# Altium schematic sheet BUCK-BOOST电路.SchDoc
size A4
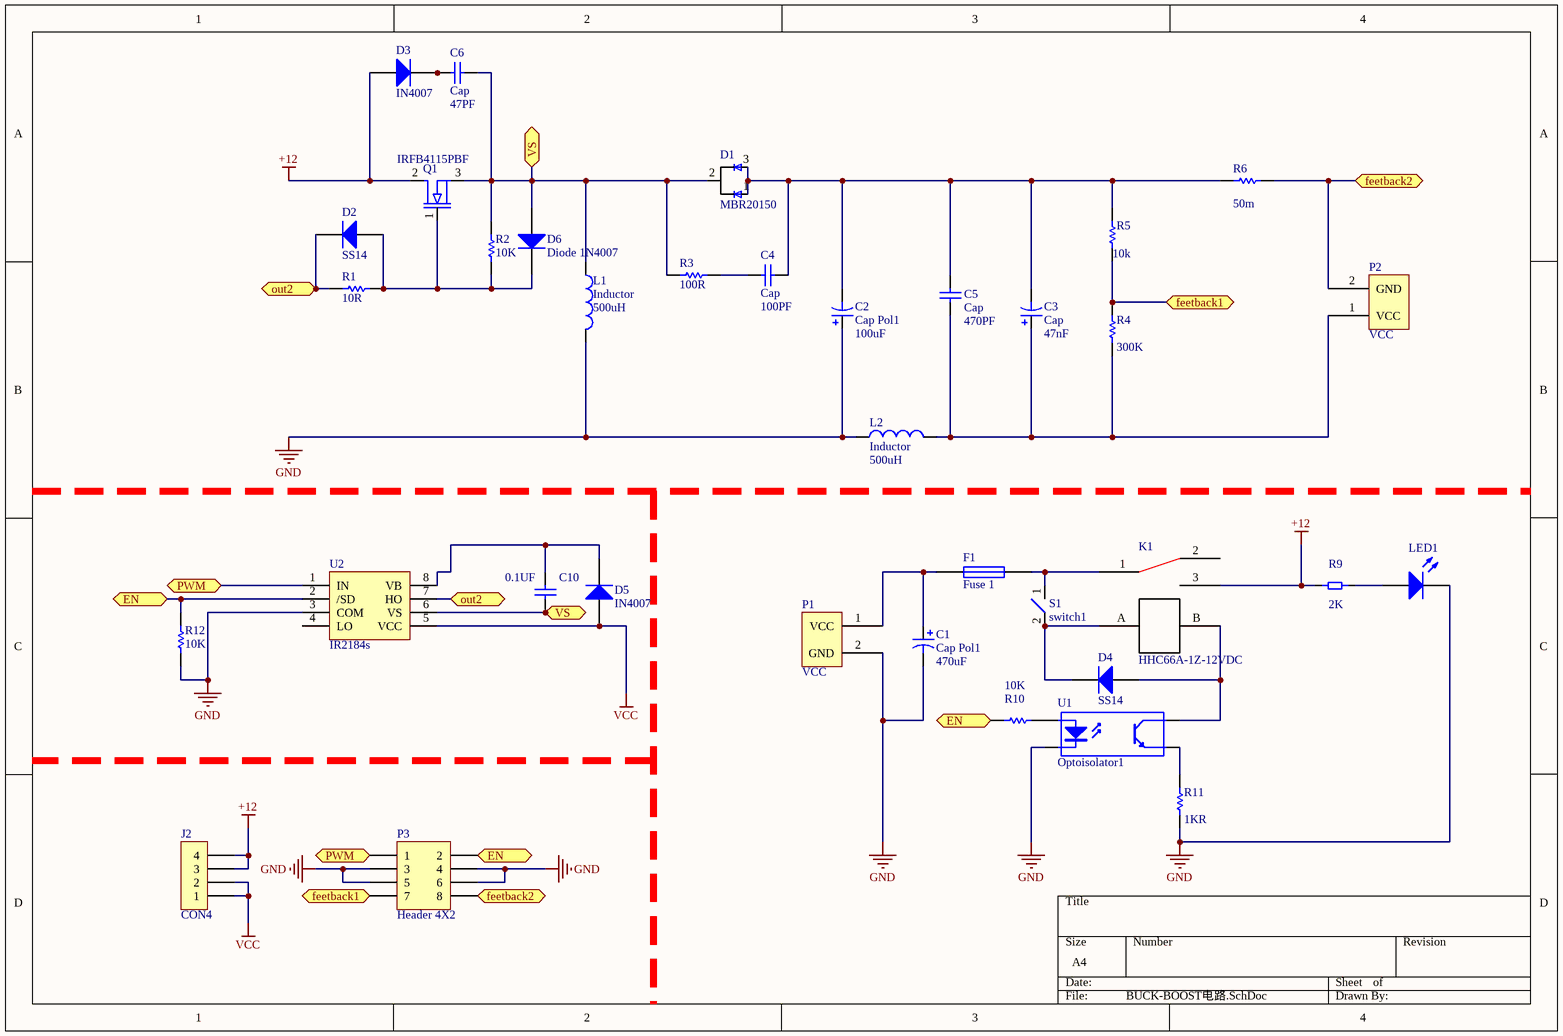
[diagram p0: BUCK-BOOST电路.SchDoc]

## Parts
C1  Cap Pol1  value 470uF  [Elector_470uf_8*9/12*3mm]
C2  Cap Pol1  value 100uF  [RB5-10.5]
C3  Cap  value 47nF  [cb2]
C4  Cap  value 100PF  [CB2]
C5  Cap  value 470PF  [cb2]
C6  Cap  value 47PF  [CB1]
C10  value 0.1UF  [1206]  (hidden comment: Cap)
D1  MBR20150  [lm317带散热片]
D2  SS14  [SK34-SMB/DO-214AA]
D3  IN4007  [AXIAL0.1Z]
D4  SS14  [SK34-SMB/DO-214AA]
D5  IN4007  [AXIAL0.1Z]
D6  Diode 1N4007  [AXIAL0.1Z]
F1  Fuse 1  [FUSE-L]
J2  CON4  [SIP4]
K1  HHC66A-1Z-12VDC  [HHC66A-1Z-12VDC电位器]
L1  Inductor  value 500uH  [BOOST升压电感2]
L2  Inductor  value 500uH  [BOOST电路滤波电感]
LED1  (no value)  [0603_LED]
P1  VCC  [050-2]
P2  VCC  [050-2]
P3  Header 4X2  [HDR2X4]
Q1  IRFB4115PBF  [lm317带散热片]
R1  value 10R  [0805r]  (hidden comment: Res1)
R2  value 10K  [AXIAL0.1Z]  (hidden comment: Res1)
R3  value 100R  [AXIAL0.1Z]  (hidden comment: Res1)
R4  value 300K  [AXIAL0.1Z]  (hidden comment: Res1)
R5  value 10k  [AXIAL0.1Z]  (hidden comment: Res1)
R6  value 50m  [AXIAL-0.7]  (hidden comment: Res1)
R9  2K  [0805R]
R10  value 10K  [0805R]  (hidden comment: Res1)
R11  value 1KR  [0805R]  (hidden comment: Res1)
R12  value 10K  [0805r]  (hidden comment: Res1)
S1  switch1  [Switch_8.2*5.2]
U1  Optoisolator1  [DIP-4]
U2  IR2184s  [SO-8NB]

## Ports
EN, feetback1, feetback2, out2, PWM, VS

## Nets
+12: D3.1(A) J2.3 J2.4 K1.3 Q1.2(D) R9.2
GND: C1.2 C2.1 L1.2 L2.1 LED1.2(K) P1.2(GND) P3.3 P3.4 P3.5 P3.6 R11.1 R12.2 U1.2(K) U2.3(COM)
VCC: D5.1(A) J2.1 J2.2 U2.5(VCC)
EN: P3.2 R10.1 R12.1 U2.2(/SD) ; port EN
feetback1: P3.7 R4.2 R5.1 ; port feetback1
feetback2: P2.2(GND) P3.8 R6.1 ; port feetback2
out2: D2.2(K) R1.1 U2.7(HO) ; port out2
PWM: P3.1 U2.1(IN) ; port PWM
VS: C6.1 C10.1 D1.2 D6.1(A) L1.1 Q1.3(S) R2.1 R3.1 U2.6(VS) ; port VS
NetC1_1: C1.1 F1.1 P1.1(VCC)
NetC2_2: C2.2 C3.2 C4.2 C5.2 D1.1 D1.3 R5.2 R6.2
NetC3_1: C3.1 C5.1 L2.2 P2.1(VCC) R4.1
NetC4_1: C4.1 R3.2
NetC6_2: C6.2 D3.2(K)
NetC10_2: C10.2 D5.2(K) U2.8(VB)
NetD2_1: D2.1(A) D6.2(K) Q1.1(G) R1.2 R2.2
NetD4_1: D4.1(A) K1.B U1.4(C)
NetD4_2: D4.2(K) K1.A S1.2
NetF1_2: F1.2 K1.1 S1.1
NetLED1_1: LED1.1(A) R9.1
NetR10_2: R10.2 U1.1(A)
NetR11_2: R11.2 U1.3(E)

Not connected (* = marked no-connect by the designer): K1 2; U2 4(LO)

## Library data of the parts
C1-C3 = Cap Pol1: Polarized Capacitor (Radial); Published: 8-Jun-2000; LatestRevisionDate: 17-Jul-2002; LatestRevisionNote: Re-released for DXP Platform.; PackageReference: RB7.6-15; Publisher: Altium Limited; PackageDescription: Polarized Capacitor (Radial); 2 Leads
C4-C6 C10 = Cap: Capacitor; Published: 8-Jun-2000; LatestRevisionDate: 17-Jul-2002; LatestRevisionNote: Re-released for DXP Platform.; PackageReference: RAD-0.3; Publisher: Altium Limited; PackageDescription: Radial Cap, Thru-Hole; 2 Leads; 0.3 in Pin Spacing
D2-D5 = Diode: Default Diode; Published: 8-Jun-2000; LatestRevisionDate: 17-Jul-2002; LatestRevisionNote: Re-released for DXP Platform.; PackageVersion: Sep-1996; PackageReference: SMC; Publisher: Altium Limited; PackageDescription: DO-214-AB/SMC; 2 C-Bend Leads; Body 7.9 x 5.9 mm, inc. leads (LxW); Code_JEDEC: DO-214-AB
D6 = Diode 1N4001: 1 Amp General Purpose Rectifier; Published: 8-Jun-2000; LatestRevisionDate: 17-Jul-2002; LatestRevisionNote: Re-released for DXP Platform.; DatasheetVersion: 1998; PackageVersion: Aug-1999; PackageReference: DO-41; Publisher: Altium Limited; PackageDescription: Diode, Axial; Body 5.2 x 2.7 mm (LxDia. max), Lead Dia. 0.86 mm (max); Code_JEDEC: DO-204-AL; ComponentLink1Description: Manufacturer Link; ComponentLink1URL: http://www.fairchildsemi.com/; ComponentLink2Description: Datasheet; ComponentLink2URL: http://www.fairchildsemi.com/ds/1N%2F1N4001.pdf
F1 = Fuse 1: Fuse; Published: 8-Jun-2000; LatestRevisionDate: 17-Jul-2002; LatestRevisionNote: Re-released for DXP Platform.; PackageReference: PIN-W2/E2.8; Publisher: Altium Limited; PackageDescription: Thru-Hole; 2 Leads
J2 = CON4: Connector
L1 L2 = Inductor: pin to pad: 1>2 2>1; Code_IEC: 1005; Published: 8-Jun-2000; LatestRevisionDate: 29-May-2009; LatestRevisionNote: IPC-7351 Footprint Added.; PackageReference: 0402-A; Publisher: Altium Limited; PackageDescription: Chip Inductor; Code_JEITA: 0402
LED1 = LED2: Typical RED, GREEN, YELLOW, AMBER GaAs LED; Published: 8-Jun-2000; LatestRevisionDate: 17-Jul-2002; LatestRevisionNote: Re-released for DXP Platform.; PackageVersion: Feb-2002; PackageReference: 3.2X1.6X1.1; Publisher: Altium Limited; PackageDescription: SM LED; 2 Flat Leads
P1 = POWER: pin to pad: 1>2 2>1
P2 = POWER
P3 = Header 4X2: Header, 4-Pin, Dual row; LatestRevisionDate: 17-Jul-2002; LatestRevisionNote: Re-released for DXP Platform.; Publisher: Altium Limited
R1-R6 R10-R12 = Res1: Resistor; Published: 8-Jun-2000; LatestRevisionDate: 17-Jul-2002; LatestRevisionNote: Re-released for DXP Platform.; PackageReference: AXIAL-0.3; Publisher: Altium Limited; PackageDescription: Axial Device, Thru-Hole; 2 Leads; 0.3 in Pin Spacing
R9 = RES
U1 = Optoisolator1: 4-Pin Phototransistor Optocoupler; Published: 24-Mar-1999; LatestRevisionDate: 04-Mar-2005; LatestRevisionNote: Sch pins 3 & 4 Swapped.; DatasheetVersion: Nov-2003; PackageReference: DIP-4; Publisher: Altium Limited